# EAGLE schematic chcp_schematic (EAGLE 6.5.0)
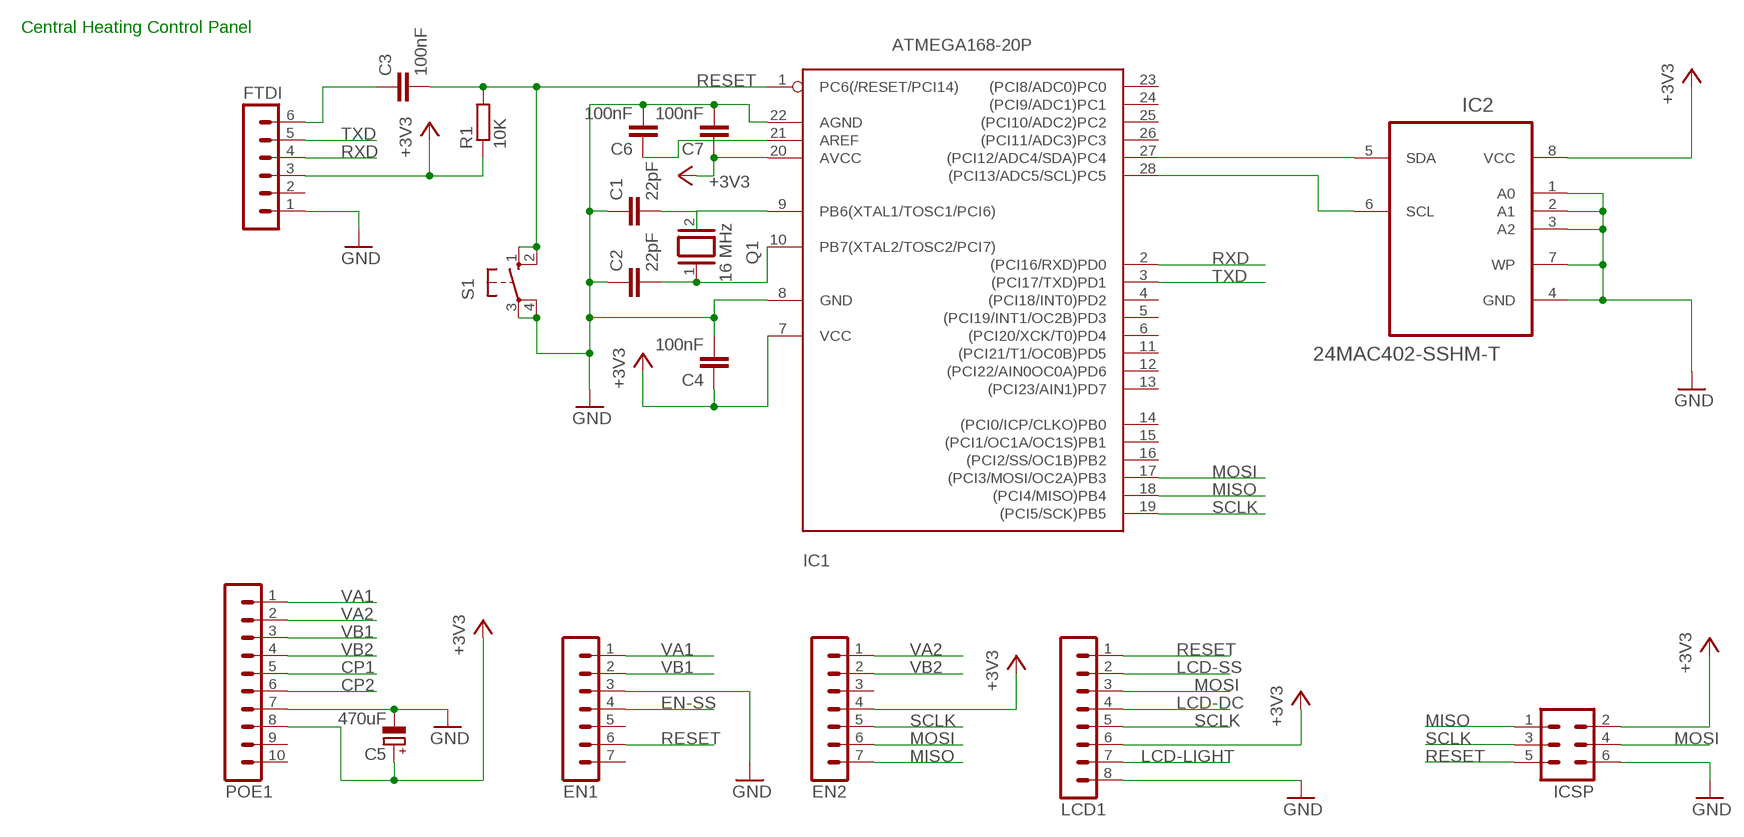
[diagram p0: schematic, sheet 1]

## Parts
C1  22pF  C-EU025-024X044  [C025-024X044]
C2  22pF  C-EU025-024X044  [C025-024X044]
C3  100nF  C-EU025-024X044  [C025-024X044]
C4  100nF  C-EU025-024X044  [C025-024X044]
C5  470uF  CPOL-EUE2.5-5  [E2,5-5]
C6  100nF  C-EU025-024X044  [C025-024X044]
C7  100nF  C-EU025-024X044  [C025-024X044]
EN1  MA07-1  [MA07-1]
EN2  MA07-1  [MA07-1]
FTDI  MA06-1  [MA06-1]
IC1  ATMEGA168-20P  [DIL28-3]
IC2  24MAC402-SSHM-T  [SOIC127P600X175-8N]
ICSP  MA03-2  [MA03-2]
LCD1  MA08-1  [MA08-1]
POE1  MA10-1  [MA10-1]
Q1  16 MHz  XTAL/S  [QS]
R1  10K  R-EU_0204/7  [0204/7]
S1  10-XX  [B3F-10XX]

## Nets
+3V3: C4.1 C5.+ C7.1 EN2.4 FTDI.3 IC1.7(VCC) IC1.20(AVCC) IC2.8(VCC) ICSP.2 LCD1.6 POE1.8 R1.1
CP1: POE1.5
CP2: POE1.6
EN-SS: EN1.4
GND: C1.1 C2.1 C4.2 C5.- C6.2 C7.2 EN1.3 FTDI.1 IC1.8(GND) IC1.22(AGND) IC2.1(A0) IC2.2(A1) IC2.3(A2) IC2.4(GND) IC2.7(WP) ICSP.6 LCD1.8 POE1.7 S1.3(P) S1.4(P1)
LCD-DC: LCD1.4
LCD-LIGHT: LCD1.7
LCD-SS: LCD1.2
MISO: EN2.7 IC1.18((PCI4/MISO)PB4) ICSP.1
MOSI: EN2.6 IC1.17((PCI3/MOSI/OC2A)PB3) ICSP.4 LCD1.3
N$1: C1.2 Q1.2
N$2: IC1.27((PCI12/ADC4/SDA)PC4) IC2.5(SDA)
N$3: IC1.28((PCI13/ADC5/SCL)PC5) IC2.6(SCL)
N$4: C2.2 IC1.10(PB7(XTAL2/TOSC2/PCI7)) Q1.1
N$5: C3.1 FTDI.6
N$6: IC1.9(PB6(XTAL1/TOSC1/PCI6))
N$7: C6.1 IC1.21(AREF)
RESET: C3.2 EN1.6 IC1.1(PC6(/RESET/PCI14)) ICSP.5 LCD1.1 R1.2 S1.1(S) S1.2(S1)
RXD: FTDI.4 IC1.2((PCI16/RXD)PD0)
SCLK: EN2.5 IC1.19((PCI5/SCK)PB5) ICSP.3 LCD1.5
TXD: FTDI.5 IC1.3((PCI17/TXD)PD1)
VA1: EN1.1 POE1.1
VA2: EN2.1 POE1.2
VB1: EN1.2 POE1.3
VB2: EN2.2 POE1.4
Unconnected: EN1.5 EN1.7 EN2.3 FTDI.2 IC1.4((PCI18/INT0)PD2) IC1.5((PCI19/INT1/OC2B)PD3) IC1.6((PCI20/XCK/T0)PD4) IC1.11((PCI21/T1/OC0B)PD5) IC1.12((PCI22/AIN0OC0A)PD6) IC1.13((PCI23/AIN1)PD7) IC1.14((PCI0/ICP/CLKO)PB0) IC1.15((PCI1/OC1A/OC1S)PB1) IC1.16((PCI2/SS/OC1B)PB2) IC1.23((PCI8/ADC0)PC0) IC1.24((PCI9/ADC1)PC1) IC1.25((PCI10/ADC2)PC2) IC1.26((PCI11/ADC3)PC3) POE1.9 POE1.10

## Notes on the sheet
- Central Heating Control Panel

## Library data of the parts
C1-C4 C6 C7 = rcl:C-EU: CAPACITOR, European symbol
C5 = rcl:CPOL-EU: POLARIZED CAPACITOR, European symbol
EN1 EN2 = con-lstb:MA07-1: PIN HEADER; OC_FARNELL: unknown; OC_NEWARK: unknown
FTDI = con-lstb:MA06-1: PIN HEADER; OC_FARNELL: unknown; OC_NEWARK: unknown
IC1 = adafruit:ATMEGA168*P: MICROCONTROLLER 16 kBytes FLASH 1 kBytes SRAM 512 Bytes EEPROM USART 8-channel 10 bit ADC
IC2 = atmel-24mac402:24MAC402-SSHM-T: EEPROM, SERIAL, 2KB, 48-BIT MAC, 8SOIC; MPN: 24MAC402-SSHM-T; OC_FARNELL: 2134868; OC_NEWARK: unknown; PACKAGE: 8SOIC; SUPPLIER: ATMEL
ICSP = con-lstb:MA03-2: PIN HEADER; OC_FARNELL: unknown; OC_NEWARK: unknown
LCD1 = con-lstb:MA08-1: PIN HEADER; OC_FARNELL: unknown; OC_NEWARK: unknown
POE1 = con-lstb:MA10-1: PIN HEADER; OC_FARNELL: unknown; OC_NEWARK: unknown
Q1 = special:XTAL/S: CRYSTAL
R1 = rcl:R-EU_: RESISTOR, European symbol
S1 = switch-omron:10-XX: OMRON SWITCH; MPN: B3F-1000; OC_FARNELL: 176432; OC_NEWARK: 36M3542